# EAGLE schematic Schematic (EAGLE 8.7.1)
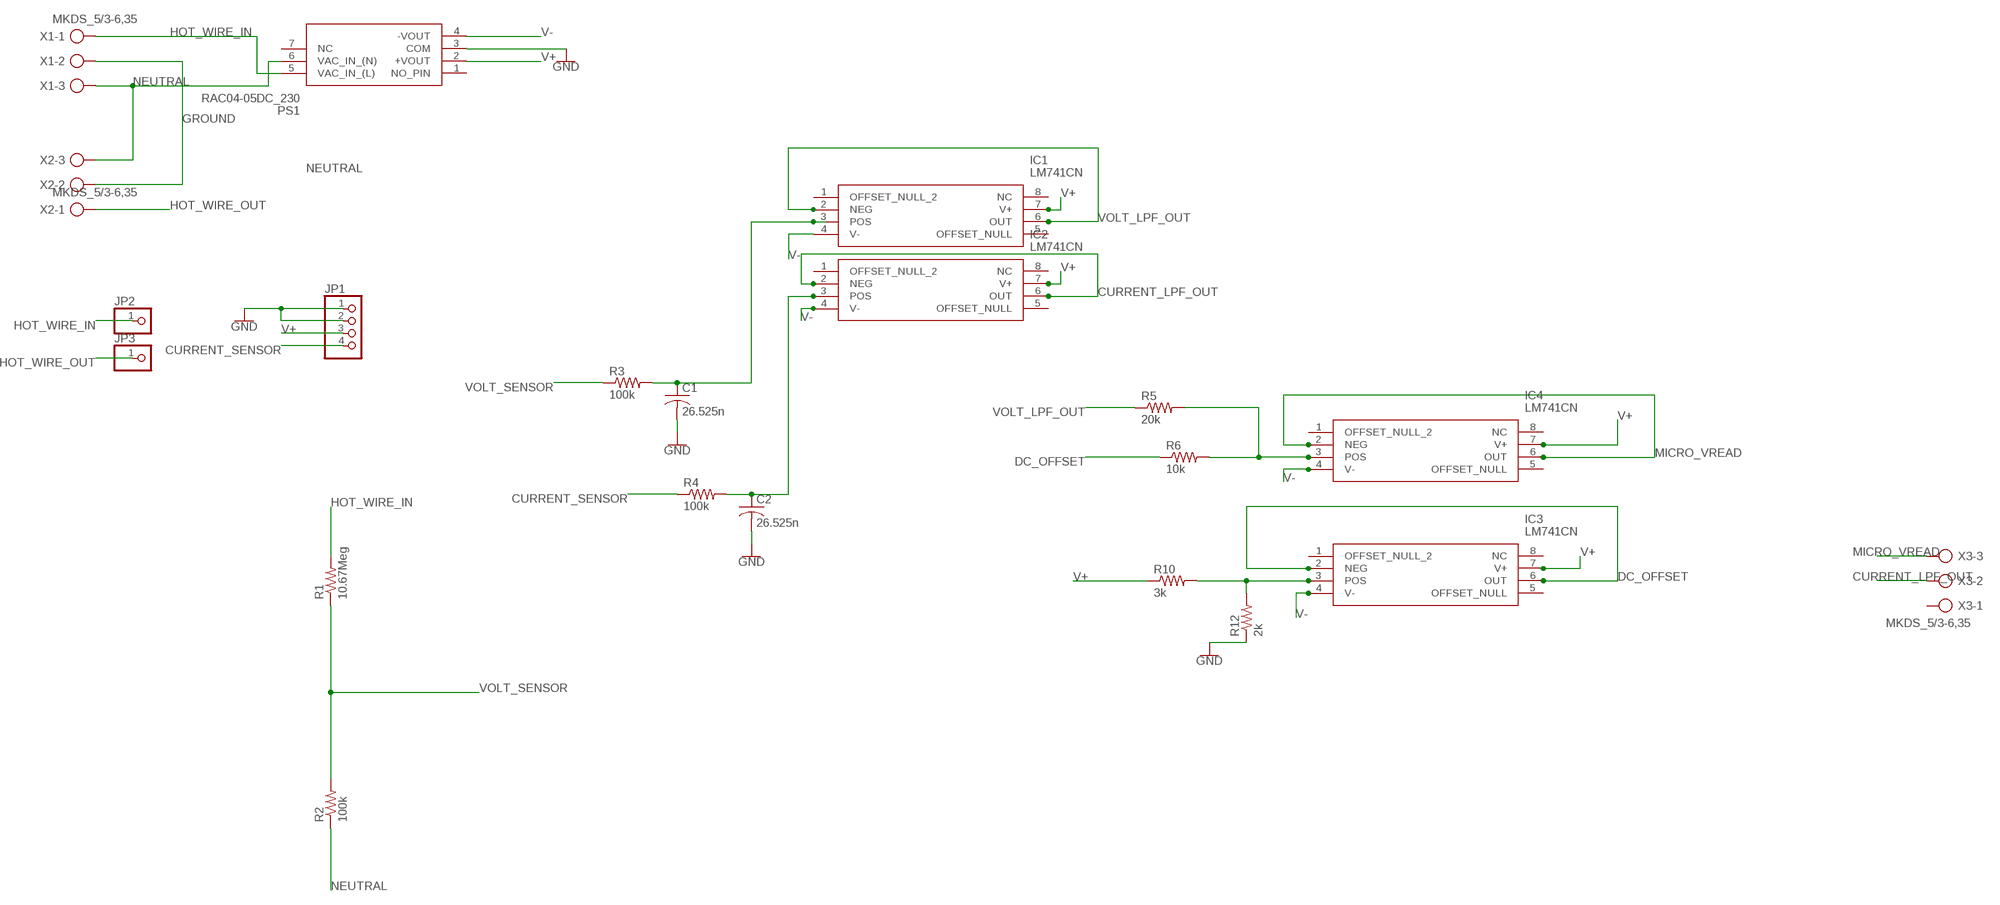
[diagram p0: schematic, sheet 1]

## Parts
C1  26.525n  C-US025-040X050  [C025-040X050]
C2  26.525n  C-US025-040X050  [C025-040X050]
IC1  LM741CN  [DIP254P762X508-8]
IC2  LM741CN  [DIP254P762X508-8]
IC3  LM741CN  [DIP254P762X508-8]
IC4  LM741CN  [DIP254P762X508-8]
JP1  PINHD-1X4  [1X04]
JP2  PINHD-1X1  [1X01]
JP3  PINHD-1X1  [1X01]
PS1  RAC04-05DC_230  [RAC04-0512DC230]
R1  10.67Meg  R-US_0617/22  [0617/22]
R2  100k  R-US_0617/22  [0617/22]
R3  100k  R-US_0617/22  [0617/22]
R4  100k  R-US_0617/22  [0617/22]
R5  20k  R-US_0617/22  [0617/22]
R6  10k  R-US_0617/22  [0617/22]
R10  3k  R-US_0617/22  [0617/22]
R12  2k  R-US_0617/22  [0617/22]
X1  MKDS_5/3-6,35  [MKDS_5/3-635]
X2  MKDS_5/3-6,35  [MKDS_5/3-635]
X3  MKDS_5/3-6,35  [MKDS_5/3-635]

## Nets
CURRENT_LPF_OUT: IC2.2(NEG) IC2.6(OUT) X3.2
CURRENT_SENSOR: JP1.4 R4.1
DC_OFFSET: IC3.2(NEG) IC3.6(OUT) R6.1
GND: C1.2 C2.2 JP1.1 JP1.2 PS1.3(COM) R12.1
GROUND [High Voltage]: X1.2 X2.2
HOT_WIRE_IN [High Voltage]: JP2.1 PS1.5(VAC_IN_(L)) R1.2 X1.1
HOT_WIRE_OUT [High Voltage]: JP3.1 X2.1
MICRO_VREAD: IC4.2(NEG) IC4.6(OUT) X3.3
N$1: C1.1 IC1.3(POS) R3.2
N$6: C2.1 IC2.3(POS) R4.2
N$8: IC4.3(POS) R5.2 R6.2
N$11: IC3.3(POS) R10.2 R12.2
NEUTRAL [High Voltage]: PS1.6(VAC_IN_(N)) R2.1 X1.3 X2.3
V+: IC1.7(V+) IC2.7(V+) IC3.7(V+) IC4.7(V+) JP1.3 PS1.2(+VOUT) R10.1
V-: IC1.4(V-) IC2.4(V-) IC3.4(V-) IC4.4(V-) PS1.4(-VOUT)
VOLT_LPF_OUT: IC1.2(NEG) IC1.6(OUT) R5.1
VOLT_SENSOR: R1.1 R2.2 R3.1
Unconnected: IC1.1(OFFSET_NULL_2) IC1.5(OFFSET_NULL) IC1.8(NC) IC2.1(OFFSET_NULL_2) IC2.5(OFFSET_NULL) IC2.8(NC) IC3.1(OFFSET_NULL_2) IC3.5(OFFSET_NULL) IC3.8(NC) IC4.1(OFFSET_NULL_2) IC4.5(OFFSET_NULL) IC4.8(NC) PS1.1(NO_PIN) PS1.7(NC) X3.1

## Library data of the parts
C1 C2 = resistor:C-US: CAPACITOR, American symbol; MPN: MC0805B224K500A5.08MM; OC_NEWARK: 46P6280
IC1-IC4 = SamacSys_Parts:LM741CN: OP AMP Source: Datasheet; ARROW_PART_NUMBER: LM741CN; ARROW_PRICE/STOCK: http://uk.rs-online.com/web/p/products/4718749; DESCRIPTION: OP AMP; HEIGHT: mm; MANUFACTURER_NAME: National Semiconductor; MANUFACTURER_PART_NUMBER: LM741CN; RS_PART_NUMBER: 4718749; RS_PRICE/STOCK: http://uk.rs-online.com/web/p/products/4718749
JP1 = pinhead:PINHD-1X4: PIN HEADER
JP2 JP3 = adafruit:PINHD-1X1: Pin header 1x1 for 0.1" spacing With round pins
PS1 = SamacSys_Parts:RAC04-05DC_230: Recom 4W Dual Output Embedded Switch Mode Power Supply SMPS, 400mA, 5V dc Source: Datasheet <https://www.recom-power.com/pdf/Powerline-AC-DC/RAC04-S_DC_230.pdf>; DESCRIPTION: Recom 4W Dual Output Embedded Switch Mode Power Supply SMPS, 400mA, 5V dc; HEIGHT: mm; MANUFACTURER_NAME: RECOM Power; MANUFACTURER_PART_NUMBER: RAC04-05DC/230; RS_PART_NUMBER: 1666726; RS_PRICE/STOCK: http://uk.rs-online.com/web/p/products/1666726
R1 = resistor:R-US_: RESISTOR, American symbol; OC_NEWARK: unknown
R2 = resistor:R-US_: RESISTOR, American symbol; MPN: MFR3-100KFC; OC_NEWARK: 78R4845
R3 R4 = resistor:R-US_: RESISTOR, American symbol; MPN: MFR3-1K0FC; OC_NEWARK: 78R4838
R5 = resistor:R-US_: RESISTOR, American symbol; MPN: MFR4-20KFI; OC_NEWARK: 78R4890
R6 = resistor:R-US_: RESISTOR, American symbol; MPN: CCF5510K0FKE36; OC_NEWARK: 71M1030
R10 = resistor:R-US_: RESISTOR, American symbol; MPN: MFR4 3K3 1%; OC_NEWARK: 97K4870
R12 = resistor:R-US_: RESISTOR, American symbol; MPN: MFR4-2K0FI; OC_NEWARK: 78R4886
X1 X2 = con-phoenix-mkds_5:MKDS_5/3-: MKDS 5/3-6,35 Source: PHOENIX CONTACT; MF: FARNELL; MPN: 1714968; OC_FARNELL: 3704695; OC_NEWARK: 71C4092
X3 = con-phoenix-mkds_5:MKDS_5/3-: MKDS 5/3-6,35 Source: PHOENIX CONTACT; MF: FARNELL; MPN: 1714968; OC_FARNELL: 3704695; OC_NEWARK: 71C4092; SPICEPREFIX: X

## Net classes
0 Standard: width 0.102 mm, clearance 0.127 mm
1 High Voltage: width 1.016 mm, clearance 1.016 mm